# EAGLE design E22-XXXMXXS (EAGLE 9.6.2)
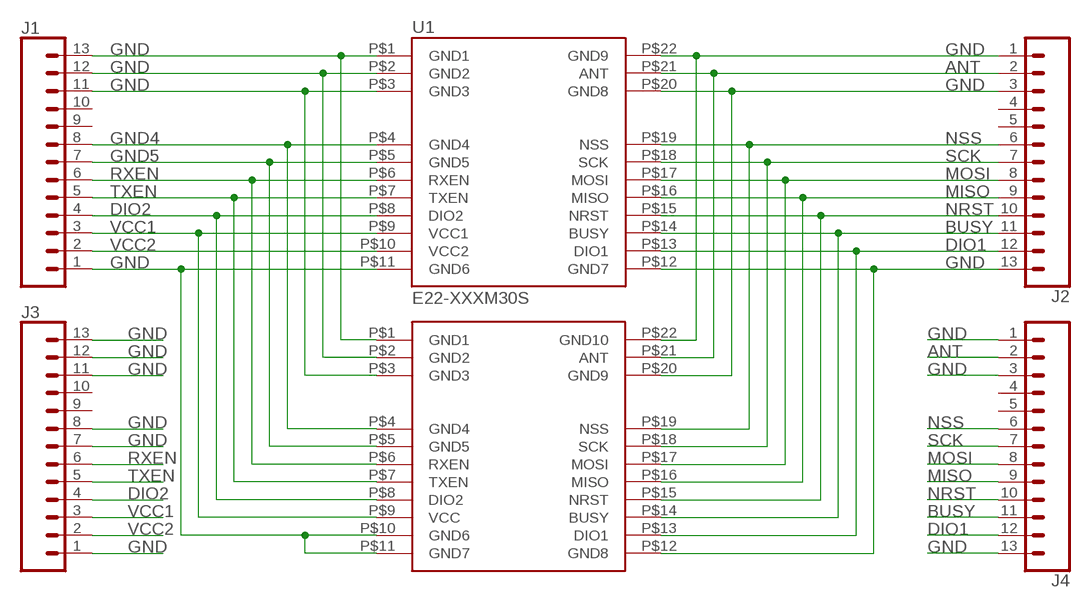
[diagram p0: schematic, sheet 1]

## Parts
J1  CONN_13  [1X13]
J2  CONN_13  [1X13]
J3  CONN_13  [1X13]
J4  CONN_13  [1X13]
U1  E22-XXXM30S  [E22-XXXM30S]
U$1  E22-XXXM22S  [E22-XXXM22S]

## Nets
ANT: J2.2 J4.2 U1.P$21(ANT) U$1.P$21(ANT)
BUSY: J2.11 J4.11 U1.P$14(BUSY) U$1.P$14(BUSY)
DIO1: J2.12 J4.12 U1.P$13(DIO1) U$1.P$13(DIO1)
DIO2: J1.4 J3.4 U1.P$8(DIO2) U$1.P$8(DIO2)
GND: J1.1 J1.11 J1.12 J1.13 J2.1 J2.3 J2.13 J3.1 J3.7 J3.8 J3.11 J3.12 J3.13 J4.1 J4.3 J4.13 U1.P$1(GND1) U1.P$2(GND2) U1.P$3(GND3) U1.P$11(GND6) U1.P$12(GND7) U1.P$20(GND8) U1.P$22(GND9) U$1.P$1(GND1) U$1.P$2(GND2) U$1.P$3(GND3) U$1.P$10(GND6) U$1.P$11(GND7) U$1.P$12(GND8) U$1.P$20(GND9) U$1.P$22(GND10)
GND4: J1.8 U1.P$4(GND4) U$1.P$4(GND4)
GND5: J1.7 U1.P$5(GND5) U$1.P$5(GND5)
MISO: J2.9 J4.9 U1.P$16(MISO) U$1.P$16(MISO)
MOSI: J2.8 J4.8 U1.P$17(MOSI) U$1.P$17(MOSI)
NRST: J2.10 J4.10 U1.P$15(NRST) U$1.P$15(NRST)
NSS: J2.6 J4.6 U1.P$19(NSS) U$1.P$19(NSS)
RXEN: J1.6 J3.6 U1.P$6(RXEN) U$1.P$6(RXEN)
SCK: J2.7 J4.7 U1.P$18(SCK) U$1.P$18(SCK)
TXEN: J1.5 J3.5 U1.P$7(TXEN) U$1.P$7(TXEN)
VCC1: J1.3 J3.3 U1.P$9(VCC1) U$1.P$9(VCC)
VCC2: J1.2 J3.2 U1.P$10(VCC2)
Unconnected: J1.9 J1.10 J2.4 J2.5 J3.9 J3.10 J4.4 J4.5

## Library data of the parts
J1-J4 = SparkFun-Connectors:CONN_13: Multi connection point. Often used as Generic Header-pin footprint for 0.1 inch spaced/style header connections On any of the 0.1 inch spaced packages, you can populate with these: Break Away Headers - Straight <https://www.sparkfun.com/products/116> (PRT-00116) Break Away Male Headers - Right Angle <https://www.sparkfun.com/products/553> (PRT-00553) Female Headers <https://www.sparkfun.com/products/115> (PRT-00115) Break Away Headers - Machine Pin <https://www.sparkfun.com/products/117> (PRT-00117) Break Away Female Headers - Swiss Machine Pin <https://www.sparkfun.com/products/743> (PRT-00743) For SCREWTERMINALS and SPRING TERMINALS visit here: Screw Terimnals on SparkFun.com <https://www.sparkfun.com/search/results?term=Screw+Terminals> (5mm/3.5mm/2.54mm spacing) This device is also useful as a general connection point to wire up your design to another part of your project. Our various solder wires solder well into these plated through hole pads. Hook-Up Wire - Assortment (Stranded, 22 AWG) <https://www.sparkfun.com/products/11375> (PRT-11375) Hook-Up Wire - Assortment (Solid Core, 22 AWG) <https://www.sparkfun.com/products/11367> (PRT-11367) View the entire wire category on our website here <https://www.sparkfun.com/categories/141> Special notes: Molex polarized connector foot print use with SKU : PRT-08231 with associated crimp pins and housings. 1MM SMD Version SKU: PRT-10208 NOTES ON THE VARIANTS LOCK and LOCK_LONGPADS... This footprint was designed to help hold the alignment of a through-hole component (i.e. 6-pin header) while soldering it into place. You may notice that each hole has been shifted either up or down by 0.005 of an inch from it's more standard position (which is a perfectly straight line). This slight alteration caused the pins (the squares in the middle) to touch the edges of the holes. Because they are alternating, it causes a "brace" to hold the component in place. 0.005 has proven to be the perfect amount of "off-center" position when using our standard breakaway headers. Although looks a little odd when you look at the bare footprint, once you have a header in there, the alteration is very hard to notice. Also,if you push a header all the way into place, it is covered up entirely on the bottom side.
U1 = E22-XXXMXXS:E22-XXXM30S
U$1 = E22-XXXMXXS:E22-XXXM22S

## Board
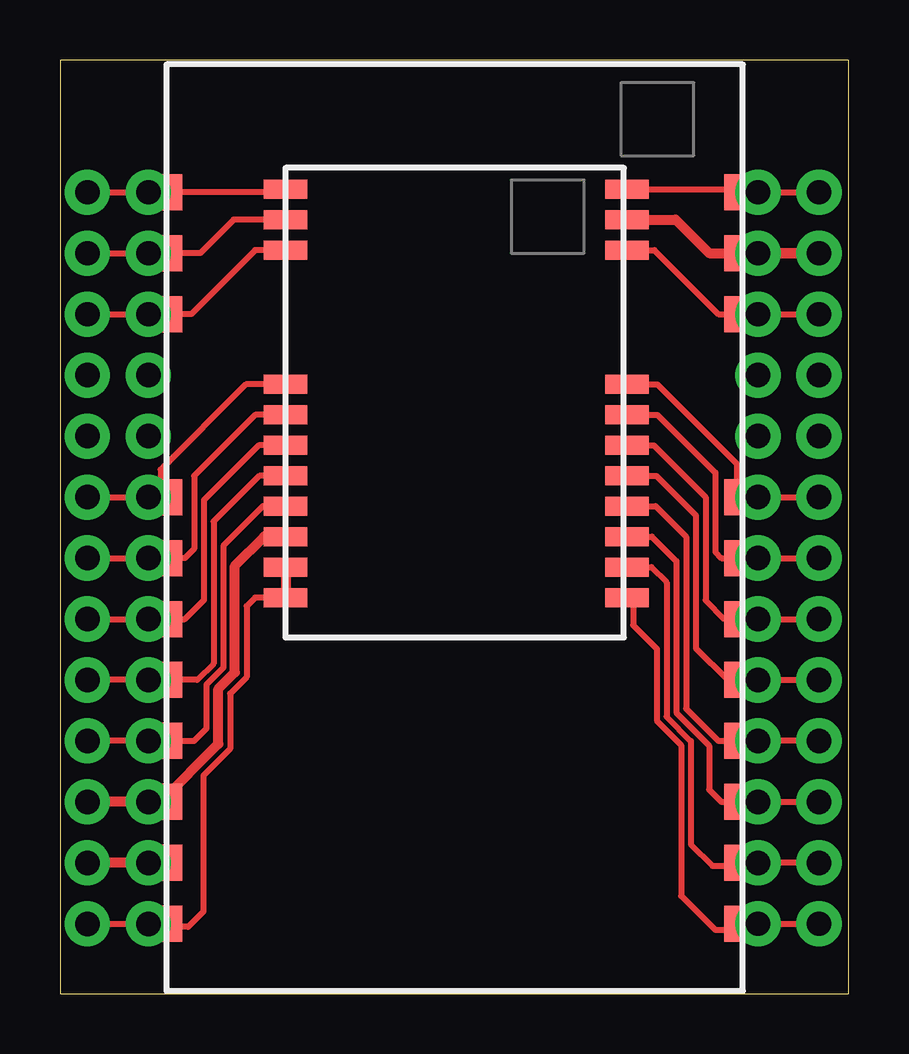
[diagram p1: board, top side]
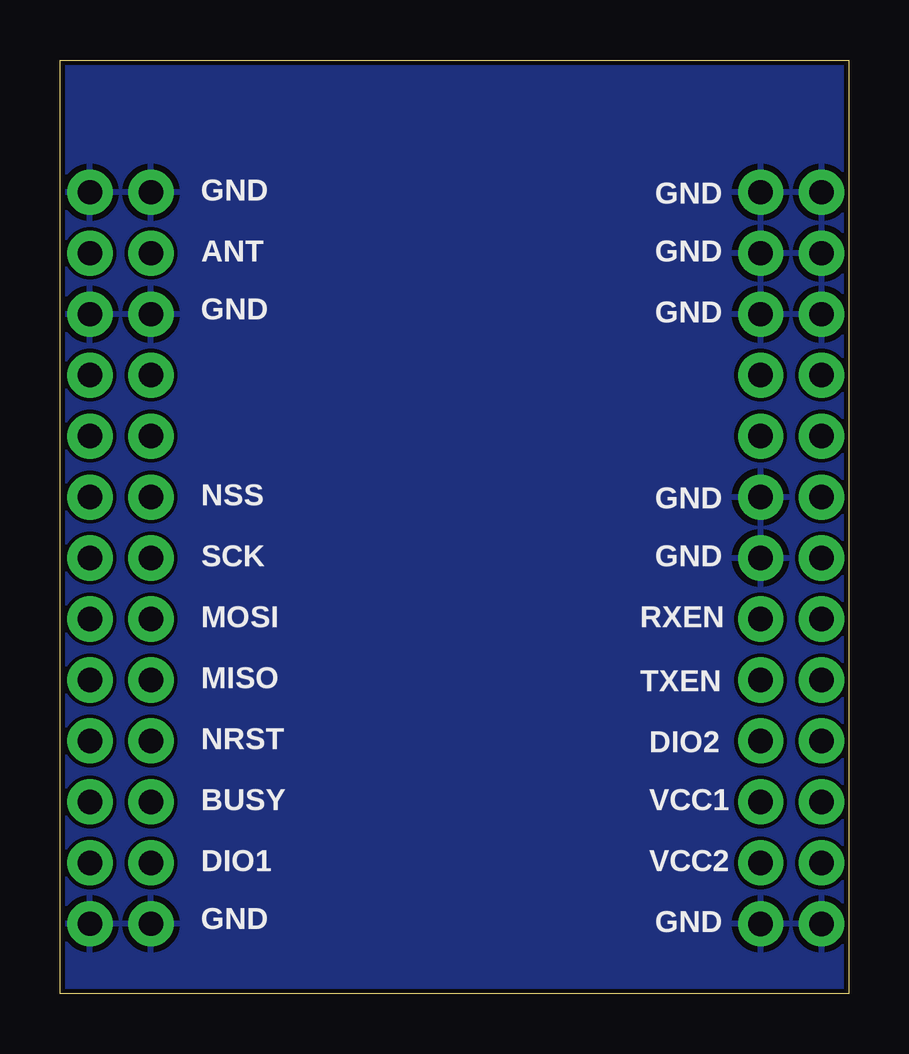
[diagram p2: board, bottom side, seen from below]

Size 32.87 x 38.91 mm. Coordinates in mm from the lower left corner, seen from the top.
Outline: 0,0 32.87,0 32.87,38.91 0,38.91 0,0
Copper layers (1*16): Top 0.035mm / dielectric 1.5mm / Bottom 0.035mm
Design rules "default *": minimum track width 6mil, minimum drill 0.35mm, track to track 6mil, track to pad 6mil, pad to pad 6mil, via to via 6mil, smd to smd 6mil, copper to edge 0.2mm, drill to drill 0.3mm, minimum pad ring 10mil, minimum via ring 8mil, stop-mask expansion 4mil, vias tented up to drill 0mil, thermal gap 10mil

### Footprints (pad centres in the part's own frame; a part is rotated, then mirrored left to right if it is on the bottom)
1X13 = drill 1.016 pad 1.88: 1 0,0; 2 2.54,0; 3 5.08,0; 4 7.62,0; 5 10.16,0; 6 12.7,0; 7 15.24,0; 8 17.78,0; 9 20.32,0; 10 22.86,0; 11 25.4,0; 12 27.94,0; 13 30.48,0
E22-XXXM30S = smd 1.8 x 1.5: P$1 -11.938,15.24; P$2 -11.938,12.7; P$3 -11.938,10.16; P$4 -11.938,2.54; P$5 -11.938,0; P$6 -11.938,-2.54; P$7 -11.938,-5.08; P$8 -11.938,-7.62; P$9 -11.938,-10.16; P$10 -11.938,-12.7; P$11 -11.938,-15.24; P$12 12.446,-15.24; P$13 12.446,-12.7; P$14 12.446,-10.16; P$15 12.446,-7.62; P$16 12.446,-5.08; P$17 12.446,-2.54; P$18 12.446,0; P$19 12.446,2.54; P$20 12.446,10.16; P$21 12.446,12.7; P$22 12.446,15.24
E22-XXXM22S = smd 1.8 x 0.78: P$1 -6.858,8.763; P$2 -6.858,7.493; P$3 -6.858,6.223; P$4 -6.858,0.635; P$5 -6.858,-0.635; P$6 -6.858,-1.905; P$7 -6.858,-3.175; P$8 -6.858,-4.445; P$9 -6.858,-5.715; P$10 -6.858,-6.985; P$11 -6.858,-8.255; P$12 7.366,-8.255; P$13 7.366,-6.985; P$14 7.366,-5.715; P$15 7.366,-4.445; P$16 7.366,-3.175; P$17 7.366,-1.905; P$18 7.366,-0.635; P$19 7.366,0.635; P$20 7.366,6.223; P$21 7.366,7.493; P$22 7.366,8.763

### Placement (x,y rotation side)
J1  1.14,2.92 90 top
J2  31.62,33.4 270 top
J3  3.68,2.92 90 top
J4  29.08,33.4 270 top
U1  16.13,18.16 0 top
U$1  16.26,24.77 0 top

### Tracks (layer width: path | path; a pad name or v marks a point on that pad's centre or on a via)
ANT
  Top 0.254: 27.05,30.86 U1.P$21 28.83,30.86
  Top 0.406: J4.2 J2.2 U1.P$21 | J4.2 28.83,30.86 | U$1.P$21 25.65,32.26 27.05,30.86 J4.2
BUSY
  Top 0.254: J2.11 J4.11 28.83,8 U1.P$14 27.56,8 27.05,8.51 27.05,10.35 25.68,11.72 25.68,18.03 24.66,19.05 U$1.P$14
DIO1
  Top 0.254: U$1.P$13 24.64,17.78 25.27,17.14 25.27,11.55 26.29,10.54 26.29,6.22 27.18,5.33 28.57,5.33 28.7,5.46 | J2.12 J4.12 | J4.12 28.7,5.46 | U1.P$13 28.7,5.46 | U1.P$13 28.96,5.46 | U1.P$13 J4.12
DIO2
  Top 0.254: U$1.P$8 8.46,20.32 6.81,18.67 6.81,13.6 6.1,12.89 6.1,11.05 5.59,10.54 4.45,10.54 U1.P$8 | U1.P$8 J1.4 | J3.4 U1.P$8
GND
  Top 0.254: J1.13 U1.P$1 9.27,33.4 U$1.P$1 | J1.12 U1.P$2 5.84,30.86 7.24,32.26 U$1.P$2 | J1.11 U1.P$3 5.46,28.32 8.13,30.99 U$1.P$3 | J1.1 3.94,2.92 | 3.94,2.92 U1.P$11 4.32,2.79 5.33,2.79 5.97,3.43 5.97,9.1 7.09,10.21 7.09,12.51 7.77,13.2 7.77,16.15 8.13,16.51 U$1.P$11 9.27,16.38 | 4.06,2.79 3.94,2.92 | J2.1 U1.P$22 28.45,33.53 U$1.P$22 | J2.3 U1.P$20 27.43,28.32 24.77,30.99 U$1.P$20 | U1.P$12 28.7,2.92 | 28.7,2.92 J2.13 | U$1.P$12 23.88,16.26 23.88,15.37 24.87,14.38 24.87,11.38 25.88,10.37 25.88,4.09 27.3,2.67 28.45,2.67 28.7,2.92
  Top 0.406: U$1.P$10 U$1.P$11
  pour Bottom: -0.13,39.12 33.02,39.12 33.02,-0.13 -0.13,-0.13
GND4
  Top 0.254: J1.8 U1.P$4 4.19,21.84 7.75,25.4 U$1.P$4
GND5
  Top 0.254: J1.7 U1.P$5 5.21,18.16 5.59,18.54 5.59,21.59 8.13,24.13 U$1.P$5
MISO
  Top 0.254: U$1.P$16 24.84,21.59 26.49,19.94 26.49,14.4 27.81,13.08 U1.P$16 J4.9 J2.9
MOSI
  Top 0.254: U$1.P$17 24.74,22.86 26.9,20.7 26.9,16.41 27.69,15.62 U1.P$17 J4.8 J2.8
NRST
  Top 0.254: U$1.P$15 24.82,20.32 26.09,19.05 26.09,11.89 27.43,10.54 U1.P$15 J4.10 J2.10
NSS
  Top 0.254: U$1.P$19 24.89,25.4 28.19,22.1 28.19,21.08 U1.P$19 | J4.6 U1.P$19 | U1.P$19 J2.6
RXEN
  Top 0.254: J1.6 J3.6 U1.P$6 5.21,15.62 5.99,16.41 5.99,20.57 8.28,22.86 U$1.P$6
SCK
  Top 0.254: U$1.P$18 24.89,24.13 27.3,21.72 27.3,18.41 27.56,18.16 U1.P$18 J4.7 J2.7
TXEN
  Top 0.254: U$1.P$7 8.31,21.59 6.4,19.68 6.4,13.77 5.71,13.08 U1.P$7 J3.5 J1.5
VCC1
  Top 0.254: J3.3 U1.P$9 3.43,8
  Top 0.406: 3.43,8 J1.3 | U1.P$9 6.6,10.41 6.6,12.71 7.29,13.4 7.29,17.83 8.51,19.05 U$1.P$9
VCC2
  Top 0.254: 3.81,5.46 U1.P$10 J3.2
  Top 0.406: 3.81,5.46 J1.2

### Text on the board
bNames: GND | GND | GND | ANT | GND | GND | GND | NSS | GND | SCK | RXEN | MOSI | TXEN | MISO | DIO2 | NRST | VCC1 | BUSY | VCC2 | DIO1 | GND | GND